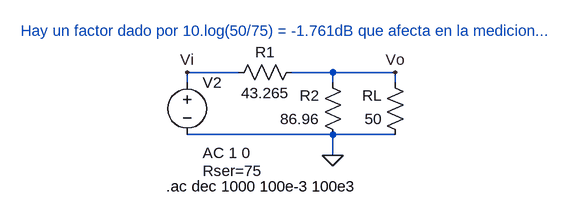
[diagram p0: schematic 2-1.asc]
2-1.asc, the LTspice schematic file:
Version 4
SHEET 1 880 680
WIRE 96 96 16 96
WIRE 240 96 176 96
WIRE 336 96 240 96
WIRE 16 112 16 96
WIRE 240 112 240 96
WIRE 336 112 336 96
WIRE 240 192 16 192
WIRE 336 192 240 192
WIRE 240 224 240 192
FLAG 240 224 0
FLAG 336 96 Vo
FLAG 16 96 Vi
SYMBOL res 192 80 R90
WINDOW 0 0 56 VBottom 2
WINDOW 3 32 56 VTop 2
SYMATTR InstName R1
SYMATTR Value 43.265
SYMBOL res 256 208 R180
WINDOW 0 36 76 Left 2
WINDOW 3 36 40 Left 2
SYMATTR InstName R2
SYMATTR Value 86.96
SYMBOL res 352 208 R180
WINDOW 0 36 76 Left 2
WINDOW 3 36 40 Left 2
SYMATTR InstName RL
SYMATTR Value 50
SYMBOL voltage 16 96 R0
WINDOW 123 24 124 Left 2
WINDOW 39 24 152 Left 2
SYMATTR Value2 AC 1 0
SYMATTR SpiceLine Rser=75
SYMATTR InstName V2
SYMATTR Value ""
TEXT -16 272 Left 2 !.ac dec 1000 100e-3 100e3
TEXT -240 32 Left 2 ;Hay un factor dado por 10.log(50/75) = -1.761dB que afecta en la medicion...

The netlist it stands for:
* 2-1.asc
R1 Vo Vi 43.265
R2 0 Vo 86.96
RL 0 Vo 50
V2 Vi 0 AC 1 0 Rser=75
.ac dec 1000 100e-3 100e3
* Hay un factor dado por 10.log(50/75) = -1.761dB que afecta en la medicion...
.backanno
.end